# Altium schematic sheet RTM_CON.SchDoc: AMC FMC Carrier v4
size 420 x 297 mm; CompanyName: WUT; Organization: WUT ISE; Address1: Warsaw Univeristy of Technology; Address2: Nowowiejska 15/19 00-665 Warsaw; Address3: t.przywozki@gmail.com; Revision: 1; SheetNumber: 20; SheetTotal: 29; Project: AMC FMC Carrier v4; ModifiedBy: -; CheckedDate: -; Title2: RTM Connector; DivGrp: ISE; Designer: T. Przywozki; ModifiedDate: -; ProjectName: ADC/DAC MEZZANINE
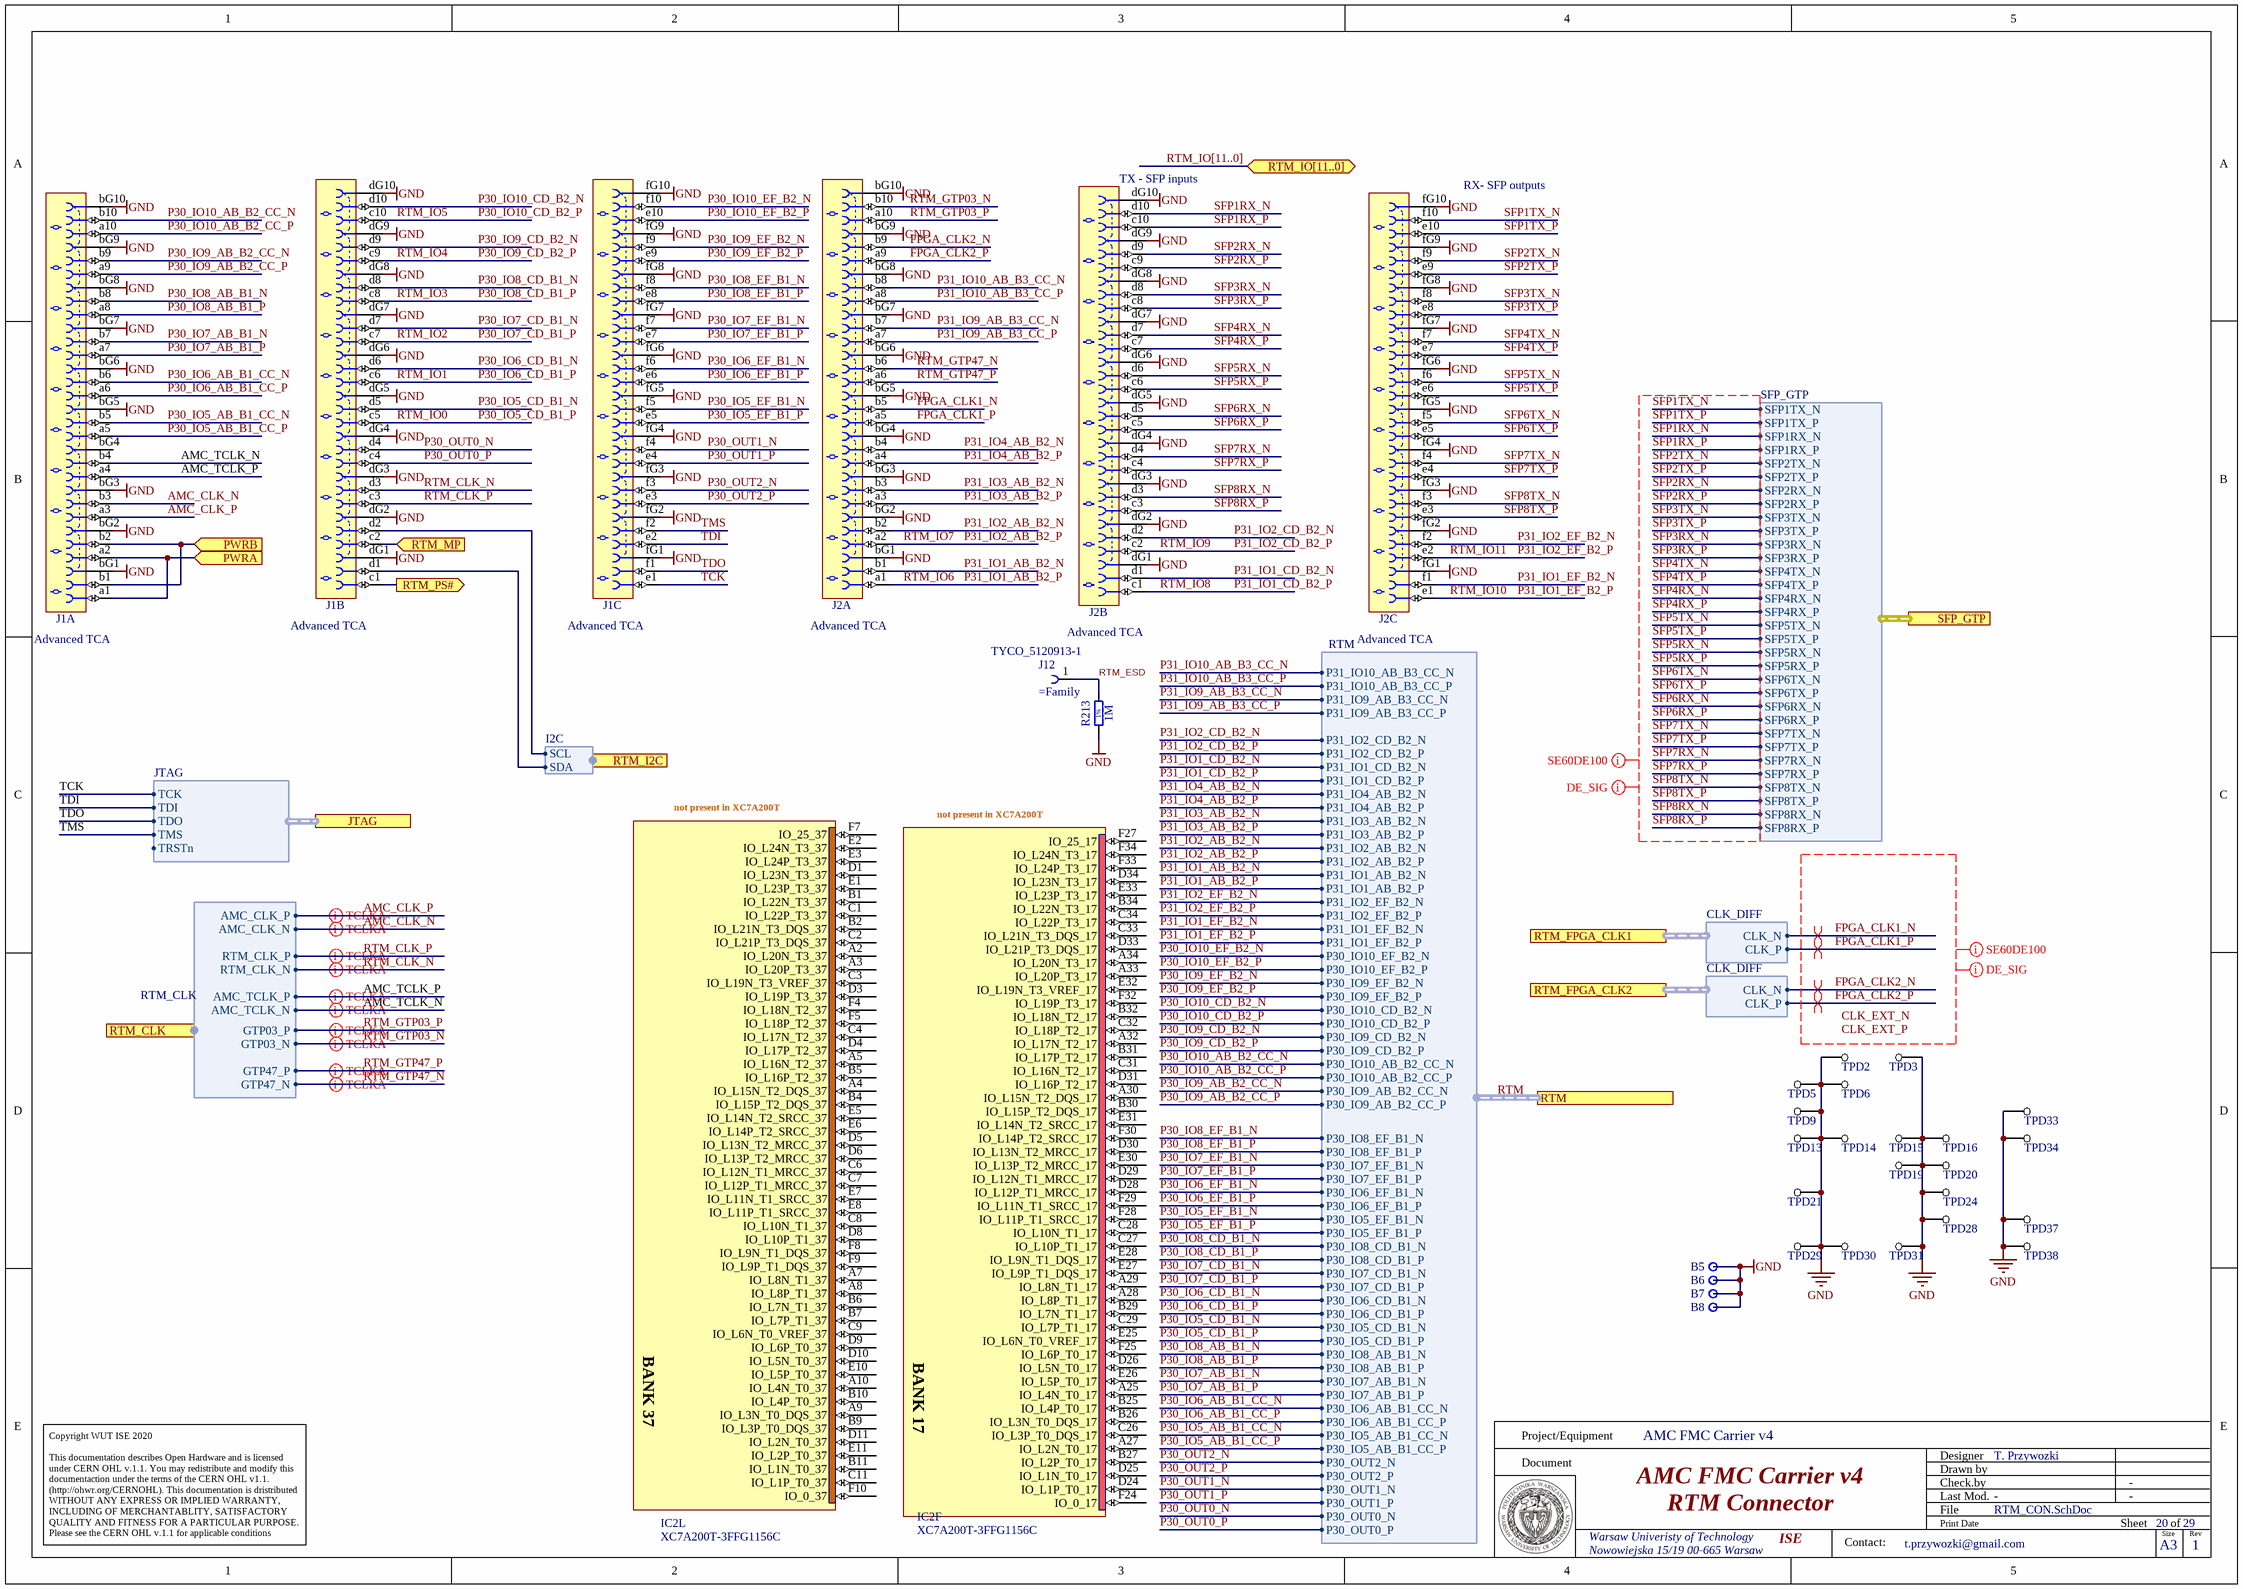
[diagram p0: RTM_CON.SchDoc]

## Parts
B5  Test Point  [VERO_20-2136]  (value not drawn)
B6  Test Point  [VERO_20-2136]  (value not drawn)
B7  Test Point  [VERO_20-2136]  (value not drawn)
B8  Test Point  [VERO_20-2136]  (value not drawn)
IC2  XC7A200T-3FFG1156C  [BGA1156C100P34X34_3500X3500X335]  (parts F,L of 23)
J1  Advanced TCA  [TYCO_6469081-1]  (parts A,B,C of 3)
J2  Advanced TCA  [TYCO_6469081-1]  (parts A,B,C of 3)
J12  (no value)  [TYCO_5120913-1]
R213  1M  [RESC5025X65N]
TPD2  Test Point  [TP_DIFF_0805]  (value not drawn)
TPD3  Test Point  [TP_DIFF_0805]  (value not drawn)
TPD5  Test Point  [TP_DIFF_0805]  (value not drawn)
TPD6  Test Point  [TP_DIFF_0805]  (value not drawn)
TPD9  Test Point  [TP_DIFF_0805]  (value not drawn)
TPD13  Test Point  [TP_DIFF_0805]  (value not drawn)
TPD14  Test Point  [TP_DIFF_0805]  (value not drawn)
TPD15  Test Point  [TP_DIFF_0805]  (value not drawn)
TPD16  Test Point  [TP_DIFF_0805]  (value not drawn)
TPD19  Test Point  [TP_DIFF_0805]  (value not drawn)
TPD20  Test Point  [TP_DIFF_0805]  (value not drawn)
TPD21  Test Point  [TP_DIFF_0805]  (value not drawn)
TPD24  Test Point  [TP_DIFF_0805]  (value not drawn)
TPD28  Test Point  [TP_DIFF_0805]  (value not drawn)
TPD29  Test Point  [TP_DIFF_0805]  (value not drawn)
TPD30  Test Point  [TP_DIFF_0805]  (value not drawn)
TPD31  Test Point  [TP_DIFF_0805]  (value not drawn)
TPD33  Test Point  [TP_DIFF_0805]  (value not drawn)
TPD34  Test Point  [TP_DIFF_0805]  (value not drawn)
TPD37  Test Point  [TP_DIFF_0805]  (value not drawn)
TPD38  Test Point  [TP_DIFF_0805]  (value not drawn)

## Ports
JTAG (harness JTAG), PWRA (in), PWRB (in), RTM (harness RTM), RTM_CLK (harness RTM_CLK), RTM_FPGA_CLK1 (harness CLK_DIFF), RTM_FPGA_CLK2 (harness CLK_DIFF), RTM_I2C (harness I2C), RTM_IO[11..0] (bidir, harness JTAG), RTM_MP (in), RTM_PS# (out), SFP_GTP (harness SFP_GTP)

## Harnesses
SFP_GTP: SFP1RX_N, SFP1RX_P, SFP1TX_N, SFP1TX_P, SFP2TX_N, SFP2TX_P, SFP2RX_N, SFP2RX_P, SFP3TX_N, SFP3TX_P, SFP3RX_N, SFP3RX_P, SFP4TX_N, SFP4TX_P, SFP4RX_N, SFP4RX_P, SFP5TX_N, SFP5TX_P, SFP5RX_N, SFP5RX_P, SFP6TX_N, SFP6TX_P, SFP6RX_N, SFP6RX_P, SFP7TX_N, SFP7TX_P, SFP7RX_N, SFP7RX_P, SFP8TX_N, SFP8TX_P, SFP8RX_N, SFP8RX_P
JTAG: TCK, TDI, TDO, TMS, TRSTn
CLK_DIFF: CLK_P, CLK_N
RTM_CLK: GTP03_P, GTP03_N, GTP47_P, GTP47_N, AMC_TCLK_P, AMC_TCLK_N, RTM_CLK_P, RTM_CLK_N, AMC_CLK_P, AMC_CLK_N
RTM: P31_IO2_CD_B2_N, P31_IO2_CD_B2_P, P31_IO10_AB_B3_CC_N, P31_IO1_CD_B2_N, P31_IO10_AB_B3_CC_P, P31_IO1_CD_B2_P, P31_IO9_AB_B3_CC_N, P31_IO4_AB_B2_N, P31_IO9_AB_B3_CC_P, P31_IO4_AB_B2_P, P30_IO9_AB_B2_CC_P, P30_IO10_CD_B2_P, P30_IO9_CD_B2_N, P30_IO9_CD_B2_P, P30_IO10_AB_B2_CC_N, P30_IO8_EF_B1_N, P30_IO10_AB_B2_CC_P, P30_IO8_EF_B1_P, P30_IO9_AB_B2_CC_N, P30_IO7_EF_B1_N, P30_OUT2_P, P30_OUT2_N, P30_OUT1_N, P30_IO5_AB_B1_CC_P, P30_OUT1_P, P30_IO5_AB_B1_CC_N, P30_OUT0_N, P30_IO6_AB_B1_CC_P, P30_OUT0_P, P30_IO7_CD_B1_P, P30_IO6_CD_B1_N, P30_IO7_EF_B1_P, P30_IO6_CD_B1_P, P30_IO6_EF_B1_N, P30_IO5_CD_B1_N, P30_IO6_EF_B1_P, P30_IO5_CD_B1_P, P30_IO5_EF_B1_N, P30_IO8_AB_B1_N, P30_IO5_EF_B1_P, P30_IO8_AB_B1_P, P30_IO8_CD_B1_N, P30_IO7_AB_B1_N, P30_IO8_CD_B1_P, P30_IO7_AB_B1_P, P30_IO7_CD_B1_N, P30_IO6_AB_B1_CC_N, P31_IO3_AB_B2_N, P31_IO3_AB_B2_P, P31_IO2_AB_B2_N, P31_IO2_AB_B2_P, P31_IO1_AB_B2_N, P31_IO1_AB_B2_P, P31_IO2_EF_B2_N, P31_IO2_EF_B2_P, P31_IO1_EF_B2_N, P31_IO1_EF_B2_P, P30_IO10_EF_B2_N, P30_IO10_EF_B2_P, P30_IO9_EF_B2_N, P30_IO9_EF_B2_P, P30_IO10_CD_B2_N
I2C: SCL, SDA

## Nets
GND: B5.1 B6.1 B7.1 B8.1 J1.bG1 J1.bG2 J1.bG3 J1.bG5 J1.bG6 J1.bG7 J1.bG8 J1.bG9 J1.bG10 J1.dG1 J1.dG2 J1.dG3 J1.dG4 J1.dG5 J1.dG6 J1.dG7 J1.dG8 J1.dG9 J1.dG10 J1.fG1 J1.fG2 J1.fG3 J1.fG4 J1.fG5 J1.fG6 J1.fG7 J1.fG8 J1.fG9 J1.fG10 J2.bG1 J2.bG2 J2.bG3 J2.bG4 J2.bG5 J2.bG6 J2.bG7 J2.bG8 J2.bG9 J2.bG10 J2.dG1 J2.dG2 J2.dG3 J2.dG4 J2.dG5 J2.dG6 J2.dG7 J2.dG8 J2.dG9 J2.dG10 J2.fG1 J2.fG2 J2.fG3 J2.fG4 J2.fG5 J2.fG6 J2.fG7 J2.fG8 J2.fG9 J2.fG10 R213.1 TPD2.1(TP) TPD3.1(TP) TPD5.1(TP) TPD6.1(TP) TPD9.1(TP) TPD13.1(TP) TPD14.1(TP) TPD15.1(TP) TPD16.1(TP) TPD19.1(TP) TPD20.1(TP) TPD21.1(TP) TPD24.1(TP) TPD28.1(TP) TPD29.1(TP) TPD30.1(TP) TPD31.1(TP) TPD33.1(TP) TPD34.1(TP) TPD37.1(TP) TPD38.1(TP)
AMC_CLK_N: J1.b3 ; port RTM_CLK.AMC_CLK_N
AMC_CLK_P: J1.a3 ; port RTM_CLK.AMC_CLK_P
AMC_TCLK_N: J1.b4 ; port RTM_CLK.AMC_TCLK_N
AMC_TCLK_P: J1.a4 ; port RTM_CLK.AMC_TCLK_P
FPGA_CLK1_N: J2.b5 ; port RTM_FPGA_CLK1.CLK_N
FPGA_CLK1_P: J2.a5 ; port RTM_FPGA_CLK1.CLK_P
FPGA_CLK2_N: J2.b9 ; port RTM_FPGA_CLK2.CLK_N
FPGA_CLK2_P: J2.a9 ; port RTM_FPGA_CLK2.CLK_P
P30_IO5_AB_B1_CC_N: J1.b5 ; port RTM.P30_IO5_AB_B1_CC_N
P30_IO5_AB_B1_CC_P: J1.a5 ; port RTM.P30_IO5_AB_B1_CC_P
P30_IO5_CD_B1_N: J1.d5 ; port RTM.P30_IO5_CD_B1_N
P30_IO5_CD_B1_P: J1.c5 ; port RTM.P30_IO5_CD_B1_P  [also labelled RTM_IO0]
P30_IO5_EF_B1_N: J1.f5 ; port RTM.P30_IO5_EF_B1_N
P30_IO5_EF_B1_P: J1.e5 ; port RTM.P30_IO5_EF_B1_P
P30_IO6_AB_B1_CC_N: J1.b6 ; port RTM.P30_IO6_AB_B1_CC_N
P30_IO6_AB_B1_CC_P: J1.a6 ; port RTM.P30_IO6_AB_B1_CC_P
P30_IO6_CD_B1_N: J1.d6 ; port RTM.P30_IO6_CD_B1_N
P30_IO6_CD_B1_P: J1.c6 ; port RTM.P30_IO6_CD_B1_P  [also labelled RTM_IO1]
P30_IO6_EF_B1_N: J1.f6 ; port RTM.P30_IO6_EF_B1_N
P30_IO6_EF_B1_P: J1.e6 ; port RTM.P30_IO6_EF_B1_P
P30_IO7_AB_B1_N: J1.b7 ; port RTM.P30_IO7_AB_B1_N
P30_IO7_AB_B1_P: J1.a7 ; port RTM.P30_IO7_AB_B1_P
P30_IO7_CD_B1_N: J1.d7 ; port RTM.P30_IO7_CD_B1_N
P30_IO7_CD_B1_P: J1.c7 ; port RTM.P30_IO7_CD_B1_P  [also labelled RTM_IO2]
P30_IO7_EF_B1_N: J1.f7 ; port RTM.P30_IO7_EF_B1_N
P30_IO7_EF_B1_P: J1.e7 ; port RTM.P30_IO7_EF_B1_P
P30_IO8_AB_B1_N: J1.b8 ; port RTM.P30_IO8_AB_B1_N
P30_IO8_AB_B1_P: J1.a8 ; port RTM.P30_IO8_AB_B1_P
P30_IO8_CD_B1_N: J1.d8 ; port RTM.P30_IO8_CD_B1_N
P30_IO8_CD_B1_P: J1.c8 ; port RTM.P30_IO8_CD_B1_P  [also labelled RTM_IO3]
P30_IO8_EF_B1_N: J1.f8 ; port RTM.P30_IO8_EF_B1_N
P30_IO8_EF_B1_P: J1.e8 ; port RTM.P30_IO8_EF_B1_P
P30_IO9_AB_B2_CC_N: J1.b9 ; port RTM.P30_IO9_AB_B2_CC_N
P30_IO9_AB_B2_CC_P: J1.a9 ; port RTM.P30_IO9_AB_B2_CC_P
P30_IO9_CD_B2_N: J1.d9 ; port RTM.P30_IO9_CD_B2_N
P30_IO9_CD_B2_P: J1.c9 ; port RTM.P30_IO9_CD_B2_P  [also labelled RTM_IO4]
P30_IO9_EF_B2_N: J1.f9 ; port RTM.P30_IO9_EF_B2_N
P30_IO9_EF_B2_P: J1.e9 ; port RTM.P30_IO9_EF_B2_P
P30_IO10_AB_B2_CC_N: J1.b10 ; port RTM.P30_IO10_AB_B2_CC_N
P30_IO10_AB_B2_CC_P: J1.a10 ; port RTM.P30_IO10_AB_B2_CC_P
P30_IO10_CD_B2_N: J1.d10 ; port RTM.P30_IO10_CD_B2_N
P30_IO10_CD_B2_P: J1.c10 ; port RTM.P30_IO10_CD_B2_P  [also labelled RTM_IO5]
P30_IO10_EF_B2_N: J1.f10 ; port RTM.P30_IO10_EF_B2_N
P30_IO10_EF_B2_P: J1.e10 ; port RTM.P30_IO10_EF_B2_P
P30_OUT0_N: J1.d4 ; port RTM.P30_OUT0_N
P30_OUT0_P: J1.c4 ; port RTM.P30_OUT0_P
P30_OUT1_N: J1.f4 ; port RTM.P30_OUT1_N
P30_OUT1_P: J1.e4 ; port RTM.P30_OUT1_P
P30_OUT2_N: J1.f3 ; port RTM.P30_OUT2_N
P30_OUT2_P: J1.e3 ; port RTM.P30_OUT2_P
P31_IO1_AB_B2_N: J2.b1 ; port RTM.P31_IO1_AB_B2_N
P31_IO1_AB_B2_P: J2.a1 ; port RTM.P31_IO1_AB_B2_P  [also labelled RTM_IO6]
P31_IO1_CD_B2_N: J2.d1 ; port RTM.P31_IO1_CD_B2_N
P31_IO1_CD_B2_P: J2.c1 ; port RTM.P31_IO1_CD_B2_P  [also labelled RTM_IO8]
P31_IO1_EF_B2_N: J2.f1 ; port RTM.P31_IO1_EF_B2_N
P31_IO1_EF_B2_P: J2.e1 ; port RTM.P31_IO1_EF_B2_P  [also labelled RTM_IO10]
P31_IO2_AB_B2_N: J2.b2 ; port RTM.P31_IO2_AB_B2_N
P31_IO2_AB_B2_P: J2.a2 ; port RTM.P31_IO2_AB_B2_P  [also labelled RTM_IO7]
P31_IO2_CD_B2_N: J2.d2 ; port RTM.P31_IO2_CD_B2_N
P31_IO2_CD_B2_P: J2.c2 ; port RTM.P31_IO2_CD_B2_P  [also labelled RTM_IO9]
P31_IO2_EF_B2_N: J2.f2 ; port RTM.P31_IO2_EF_B2_N
P31_IO2_EF_B2_P: J2.e2 ; port RTM.P31_IO2_EF_B2_P  [also labelled RTM_IO11]
P31_IO3_AB_B2_N: J2.b3 ; port RTM.P31_IO3_AB_B2_N
P31_IO3_AB_B2_P: J2.a3 ; port RTM.P31_IO3_AB_B2_P
P31_IO4_AB_B2_N: J2.b4 ; port RTM.P31_IO4_AB_B2_N
P31_IO4_AB_B2_P: J2.a4 ; port RTM.P31_IO4_AB_B2_P
P31_IO9_AB_B3_CC_N: J2.b7 ; port RTM.P31_IO9_AB_B3_CC_N
P31_IO9_AB_B3_CC_P: J2.a7 ; port RTM.P31_IO9_AB_B3_CC_P
P31_IO10_AB_B3_CC_N: J2.b8 ; port RTM.P31_IO10_AB_B3_CC_N
P31_IO10_AB_B3_CC_P: J2.a8 ; port RTM.P31_IO10_AB_B3_CC_P
PWRA: J1.a1 J1.a2 ; port PWRA
PWRB: J1.b1 J1.b2 ; port PWRB
RTM_CLK_N: J1.d3 ; port RTM_CLK.RTM_CLK_N
RTM_CLK_P: J1.c3 ; port RTM_CLK.RTM_CLK_P
RTM_ESD: J12.1 R213.2
RTM_GTP03_N: J2.b10 ; port RTM_CLK.GTP03_N
RTM_GTP03_P: J2.a10 ; port RTM_CLK.GTP03_P
RTM_GTP47_N: J2.b6 ; port RTM_CLK.GTP47_N
RTM_GTP47_P: J2.a6 ; port RTM_CLK.GTP47_P
RTM_MP: J1.c2 ; port RTM_MP
RTM_PS#: J1.c1 ; port RTM_PS#
SFP1RX_N: J2.d10 ; port SFP_GTP.SFP1RX_N
SFP1RX_P: J2.c10 ; port SFP_GTP.SFP1RX_P
SFP1TX_N: J2.f10 ; port SFP_GTP.SFP1TX_N
SFP1TX_P: J2.e10 ; port SFP_GTP.SFP1TX_P
SFP2RX_N: J2.d9 ; port SFP_GTP.SFP2RX_N
SFP2RX_P: J2.c9 ; port SFP_GTP.SFP2RX_P
SFP2TX_N: J2.f9 ; port SFP_GTP.SFP2TX_N
SFP2TX_P: J2.e9 ; port SFP_GTP.SFP2TX_P
SFP3RX_N: J2.d8 ; port SFP_GTP.SFP3RX_N
SFP3RX_P: J2.c8 ; port SFP_GTP.SFP3RX_P
SFP3TX_N: J2.f8 ; port SFP_GTP.SFP3TX_N
SFP3TX_P: J2.e8 ; port SFP_GTP.SFP3TX_P
SFP4RX_N: J2.d7 ; port SFP_GTP.SFP4RX_N
SFP4RX_P: J2.c7 ; port SFP_GTP.SFP4RX_P
SFP4TX_N: J2.f7 ; port SFP_GTP.SFP4TX_N
SFP4TX_P: J2.e7 ; port SFP_GTP.SFP4TX_P
SFP5RX_N: J2.d6 ; port SFP_GTP.SFP5RX_N
SFP5RX_P: J2.c6 ; port SFP_GTP.SFP5RX_P
SFP5TX_N: J2.f6 ; port SFP_GTP.SFP5TX_N
SFP5TX_P: J2.e6 ; port SFP_GTP.SFP5TX_P
SFP6RX_N: J2.d5 ; port SFP_GTP.SFP6RX_N
SFP6RX_P: J2.c5 ; port SFP_GTP.SFP6RX_P
SFP6TX_N: J2.f5 ; port SFP_GTP.SFP6TX_N
SFP6TX_P: J2.e5 ; port SFP_GTP.SFP6TX_P
SFP7RX_N: J2.d4 ; port SFP_GTP.SFP7RX_N
SFP7RX_P: J2.c4 ; port SFP_GTP.SFP7RX_P
SFP7TX_N: J2.f4 ; port SFP_GTP.SFP7TX_N
SFP7TX_P: J2.e4 ; port SFP_GTP.SFP7TX_P
SFP8RX_N: J2.d3 ; port SFP_GTP.SFP8RX_N
SFP8RX_P: J2.c3 ; port SFP_GTP.SFP8RX_P
SFP8TX_N: J2.f3 ; port SFP_GTP.SFP8TX_N
SFP8TX_P: J2.e3 ; port SFP_GTP.SFP8TX_P
TCK: J1.e1 ; port JTAG.TCK
TDI: J1.e2 ; port JTAG.TDI
TDO: J1.f1 ; port JTAG.TDO
TMS: J1.f2 ; port JTAG.TMS
NetJ1_d1: J1.d1 ; port RTM_I2C.SDA
NetJ1_d2: J1.d2 ; port RTM_I2C.SCL

Not connected (* = marked no-connect by the designer): IC2 A2(IO_L20N_T3_37) A3(IO_L20P_T3_37) A4(IO_L15N_T2_DQS_37) A5(IO_L16N_T2_37) A7(IO_L8N_T1_37) A8(IO_L8P_T1_37) A9(IO_L3N_T0_DQS_37) A10(IO_L4N_T0_37) A25(IO_L4N_T0_17) A27(IO_L2N_T0_17) A28(IO_L8P_T1_17) A29(IO_L8N_T1_17) A30(IO_L15N_T2_DQS_17) A32(IO_L17N_T2_17) A33(IO_L20P_T3_17) A34(IO_L20N_T3_17) B1(IO_L22N_T3_37) B2(IO_L21N_T3_DQS_37) B4(IO_L15P_T2_DQS_37) B5(IO_L16P_T2_37) B6(IO_L7N_T1_37) B7(IO_L7P_T1_37) B9(IO_L3P_T0_DQS_37) B10(IO_L4P_T0_37) B11(IO_L1N_T0_37) B25(IO_L4P_T0_17) B26(IO_L3N_T0_DQS_17) B27(IO_L2P_T0_17) B29(IO_L7N_T1_17) B30(IO_L15P_T2_DQS_17) B31(IO_L17P_T2_17) B32(IO_L18N_T2_17) B34(IO_L22N_T3_17) C1(IO_L22P_T3_37) C2(IO_L21P_T3_DQS_37) C3(IO_L19N_T3_VREF_37) C4(IO_L17N_T2_37) C6(IO_L12N_T1_MRCC_37) C7(IO_L12P_T1_MRCC_37) C8(IO_L10N_T1_37) C9(IO_L6N_T0_VREF_37) C11(IO_L1P_T0_37) C26(IO_L3P_T0_DQS_17) C27(IO_L10P_T1_17) C28(IO_L10N_T1_17) C29(IO_L7P_T1_17) C31(IO_L16N_T2_17) C32(IO_L18P_T2_17) C33(IO_L21N_T3_DQS_17) C34(IO_L22P_T3_17) D1(IO_L23N_T3_37) D3(IO_L19P_T3_37) D4(IO_L17P_T2_37) D5(IO_L13N_T2_MRCC_37) D6(IO_L13P_T2_MRCC_37) D8(IO_L10P_T1_37) D9(IO_L6P_T0_37) D10(IO_L5N_T0_37) D11(IO_L2N_T0_37) D24(IO_L1P_T0_17) D25(IO_L1N_T0_17) D26(IO_L5N_T0_17) D28(IO_L12P_T1_MRCC_17) D29(IO_L12N_T1_MRCC_17) D30(IO_L13N_T2_MRCC_17) D31(IO_L16P_T2_17) D33(IO_L21P_T3_DQS_17) D34(IO_L23N_T3_17) E1(IO_L23P_T3_37) E2(IO_L24N_T3_37) E3(IO_L24P_T3_37) E5(IO_L14N_T2_SRCC_37) E6(IO_L14P_T2_SRCC_37) E7(IO_L11N_T1_SRCC_37) E8(IO_L11P_T1_SRCC_37) E10(IO_L5P_T0_37) E11(IO_L2P_T0_37) E25(IO_L6N_T0_VREF_17) E26(IO_L5P_T0_17) E27(IO_L9P_T1_DQS_17) E28(IO_L9N_T1_DQS_17) E30(IO_L13P_T2_MRCC_17) E31(IO_L14N_T2_SRCC_17) E32(IO_L19N_T3_VREF_17) E33(IO_L23P_T3_17) F4(IO_L18N_T2_37) F5(IO_L18P_T2_37) F7(IO_25_37) F8(IO_L9N_T1_DQS_37) F9(IO_L9P_T1_DQS_37) F10(IO_0_37) F24(IO_0_17) F25(IO_L6P_T0_17) F27(IO_25_17) F28(IO_L11P_T1_SRCC_17) F29(IO_L11N_T1_SRCC_17) F30(IO_L14P_T2_SRCC_17) F32(IO_L19P_T3_17) F33(IO_L24P_T3_17) F34(IO_L24N_T3_17); J1 bG4

## Buses and harness runs
bus RTM_IO[11..0]
harness RTM = port RTM

## Layout directives
net class SE60DE100: CLK_EXT_N, CLK_EXT_P, FPGA_CLK1_N, FPGA_CLK1_P, FPGA_CLK2_N, FPGA_CLK2_P, SFP1RX_N, SFP1RX_P, SFP1TX_N, SFP1TX_P, SFP2RX_N, SFP2RX_P, SFP2TX_N, SFP2TX_P, SFP3RX_N, SFP3RX_P, SFP3TX_N, SFP3TX_P, SFP4RX_N, SFP4RX_P, SFP4TX_N, SFP4TX_P, SFP5RX_N, SFP5RX_P, SFP5TX_N, SFP5TX_P, SFP6RX_N, SFP6RX_P, SFP6TX_N, SFP6TX_P, SFP7RX_N, SFP7RX_P, SFP7TX_N, SFP7TX_P, SFP8RX_N, SFP8RX_P, SFP8TX_N, SFP8TX_P
net class DE_SIG: CLK_EXT_N, CLK_EXT_P, FPGA_CLK1_N, FPGA_CLK1_P, FPGA_CLK2_N, FPGA_CLK2_P, SFP1RX_N, SFP1RX_P, SFP1TX_N, SFP1TX_P, SFP2RX_N, SFP2RX_P, SFP2TX_N, SFP2TX_P, SFP3RX_N, SFP3RX_P, SFP3TX_N, SFP3TX_P, SFP4RX_N, SFP4RX_P, SFP4TX_N, SFP4TX_P, SFP5RX_N, SFP5RX_P, SFP5TX_N, SFP5TX_P, SFP6RX_N, SFP6RX_P, SFP6TX_N, SFP6TX_P, SFP7RX_N, SFP7RX_P, SFP7TX_N, SFP7TX_P, SFP8RX_N, SFP8RX_P, SFP8TX_N, SFP8TX_P
differential pair: AMC_CLK_N, AMC_CLK_P, AMC_TCLK_N, AMC_TCLK_P, FPGA_CLK1_N, FPGA_CLK1_P, FPGA_CLK2_N, FPGA_CLK2_P, RTM_CLK_N, RTM_CLK_P, RTM_GTP03_N, RTM_GTP03_P, RTM_GTP47_N, RTM_GTP47_P

## Notes on the sheet
- (near J2) TX - SFP inputs
- RX- SFP outputs
- not present in XC7A200T
- Labels drawn without touching a wire or pin: CLK_EXT_N, CLK_EXT_P
- Project/Equipment
- Document
- Designer
- Drawn by
- Check.by
- Copyright WUT ISE 2020
  This documentation describes Open Hardware and is licensed under CERN OHL v.1.1. You may redistribute and modify this documentaction under the terms of the CERN OHL v1.1.
  (http://ohwr.org/CERNOHL). This documentation is dristributed WITHOUT ANY EXPRESS OR IMPLIED WARRANTY, INCLUDING OF MERCHANTABLITY, SATISFACTORY QUALITY AND FITNESS FOR A PARTICULAR PURPOSE. Please see the CERN OHL v.1.1 for applicable conditions
- File
- Last Mod.
- Print Date
- Sheet
- Size
- A3
- of
- Rev
- Contact:
- (in symbol R2010_1M_1%_0.5W_200PPM) 1%
- (in symbol XC7A200T-3FFG1156C, part F) BANK 17
- (in symbol XC7A200T-3FFG1156C, part L) BANK 37

## Library data of the parts
B5-B8 = VERO_20-2136: Single Terminal Socket; Part Description: Black Bead PCB Terminal Test Pin (1.32 mm hole); Manufacturer: VERO TECHNOLOGIES; Table: Miscellaneous; Part Number: VERO_20-2136; Component Kind: Standard; Component Type: Standard; Pin Count: 1; Family: Test Point; Mounted: Yes; Socket: No; SMD: No; Status: None; Manufacturer Part Number: 20-2136; ComponentHeight: 5.3mm; HelpURL: \\cern.ch\dfs\Applications\Altium\Datasheets\VERO_20-2136.pdf; Author: CERN DEM JLC; CreateDate: 21/07/2008; LatestRevisionDate: 21/07/2008
IC2 = XC7A200T-3FFG1156C: Artix-6 FPGA, 16 GTPs, 600 User I/Os, 1156-Pin BGA, Speed Grade 2, Commercial Grade, Pb-Free; Part Description: Artix-7 FPGA, 16 GTPs, 600 User I/Os, 1156-Pin BGA, Speed Grade 2, Commercial Grade, Pb-Free; Manufacturer: XILINX; Table: Logic; Part Number: XC7A200T-3FFG1156C; Component Kind: Standard; Component Type: Standard; Device: XC7A200T-3FFG1156C; PackageDescription: BGA, 1.00mm Pitch, Square; 1156 Pin, 34 Columns X 34 Rows, 35.00mm X 35.00mm X 3.350mm H; Manufacturer Part Number: XC7A200T-3FFG1156C; Pin Count: 1156; Case: BGA1156; Mounted: Yes; Socket: No; SMD: Yes; ComponentHeight: 3.35mm; HelpURL: \\cern.ch\dfs\Applications\Altium\Datasheets\XC7A350T-2FFG1156C.pdf; ComponentLink1URL: \\cern.ch\dfs\Applications\Altium\Datasheets\XC7A350T-2FFG1156C.pdf; ComponentLink1Description: Package/Pinout; Author: CERN DEM JLC; CreateDate: 2012-09-19; LatestRevisionDate: 2012-09-19
J1 J2 = TYCO_6469081-1: Connector 60 ATCA Female 30 Pairs (60 Signals) + 3x10 Ground; Part Description: 60 Positions, Pitch 2.5mm,  Advanced TCA, Z-PACK HM-Zd Right Angle Press Fit Receptacle; Manufacturer: TYCO ELECTRONICS; Table: TYCO; Part Number: TYCO_6469081-1; Component Kind: Standard; Component Type: Standard; Pin Count: 90; Family: Advanced TCA; Mounted: Yes; Socket: No; SMD: No; Status: None; Manufacturer Part Number: 6469081-1; ComponentHeight: 12.18mm; HelpURL: \\cern.ch\dfs\Applications\Altium\Datasheets\TYCO_6469081-1.pdf; Author: CERN DEM JLC; CreateDate: 2013-08-28; LatestRevisionDate: 2013-08-28
J12 = TYCO_5120913-1: Single Pin Female; Manufacturer: TYCO ELECTRONICS; Part Description: Universal Right Angle Female Power Module Guide (keyed); PressFit: No; Manufacturer Part Number: 5120913-1; Part Number: TYCO_5120913-1; Component Kind: Standard; Component Type: Standard; Pin Count: 1; Mounted: Yes; Socket: No; SMD: No; Sense: No; Status: None; ComponentHeight: 9.78mm; HelpURL: \\cern.ch\dfs\Applications\Altium\Datasheets\TYCO_5120913-1.pdf; Author: CERN DEM JLC; CreateDate: 28.08.2013; LatestRevisionDate: 28.08.2013
R213 = R2010_1M_1%_0.5W_200PPM: Resistor - 1%; Manufacturer: GENERIC; Part Description: Thick Film Chip Resistor; Manufacturer1 Part Number: LHVC2010-1MFT4; Power: 0.5W; TC: ±200ppm/°C; PressFit: No; Manufacturer Part Number: R2010_1M_1%_0.5W_200PPM; Part Number: R2010_1M_1%_0.5W_200PPM; Tolerance: ±1%; Value: 1M; Component Kind: Standard; Component Type: Standard; Pin Count: 2; Status: None; Case: 2010; Mounted: Yes; Sense: No; Socket: No; SMD: Yes; Manufacturer1 Example: TT WELWYN; Manufacturer1 ComponentHeight: 0.65mm; HelpURL: \\cern.ch\dfs\Applications\Altium\Datasheets\R2010_WELWYN_LHVC.pdf; Author: CERN DEM JLC; CreateDate: 26.02.2015; LatestRevisionDate: 26.02.2015
TPD2 TPD3 TPD5 TPD6 TPD9 TPD13-TPD16 TPD19-TPD21 TPD24 TPD28-TPD31 TPD33 TPD34 TPD37 TPD38 = TP_DIFF: 1625854-2; Bottom_EstimationX (mm): 0; Document Name: RTM_CON.SchDoc; Part Number: TP_DIFF; ParamsList: Test Point; FootprintSizeX (mm): 4; FootprintSizeY (mm): 2; FootprintRectangleArea (mm): 8; Thickness (Max) (mm): 2; Bottom_EstimationY (mm): 0; Bottom_Area_Estimation (mm): 0; FootprintAlias: TP_SMD_0805